# EAGLE design LevelConverter (EAGLE 9.4.2)
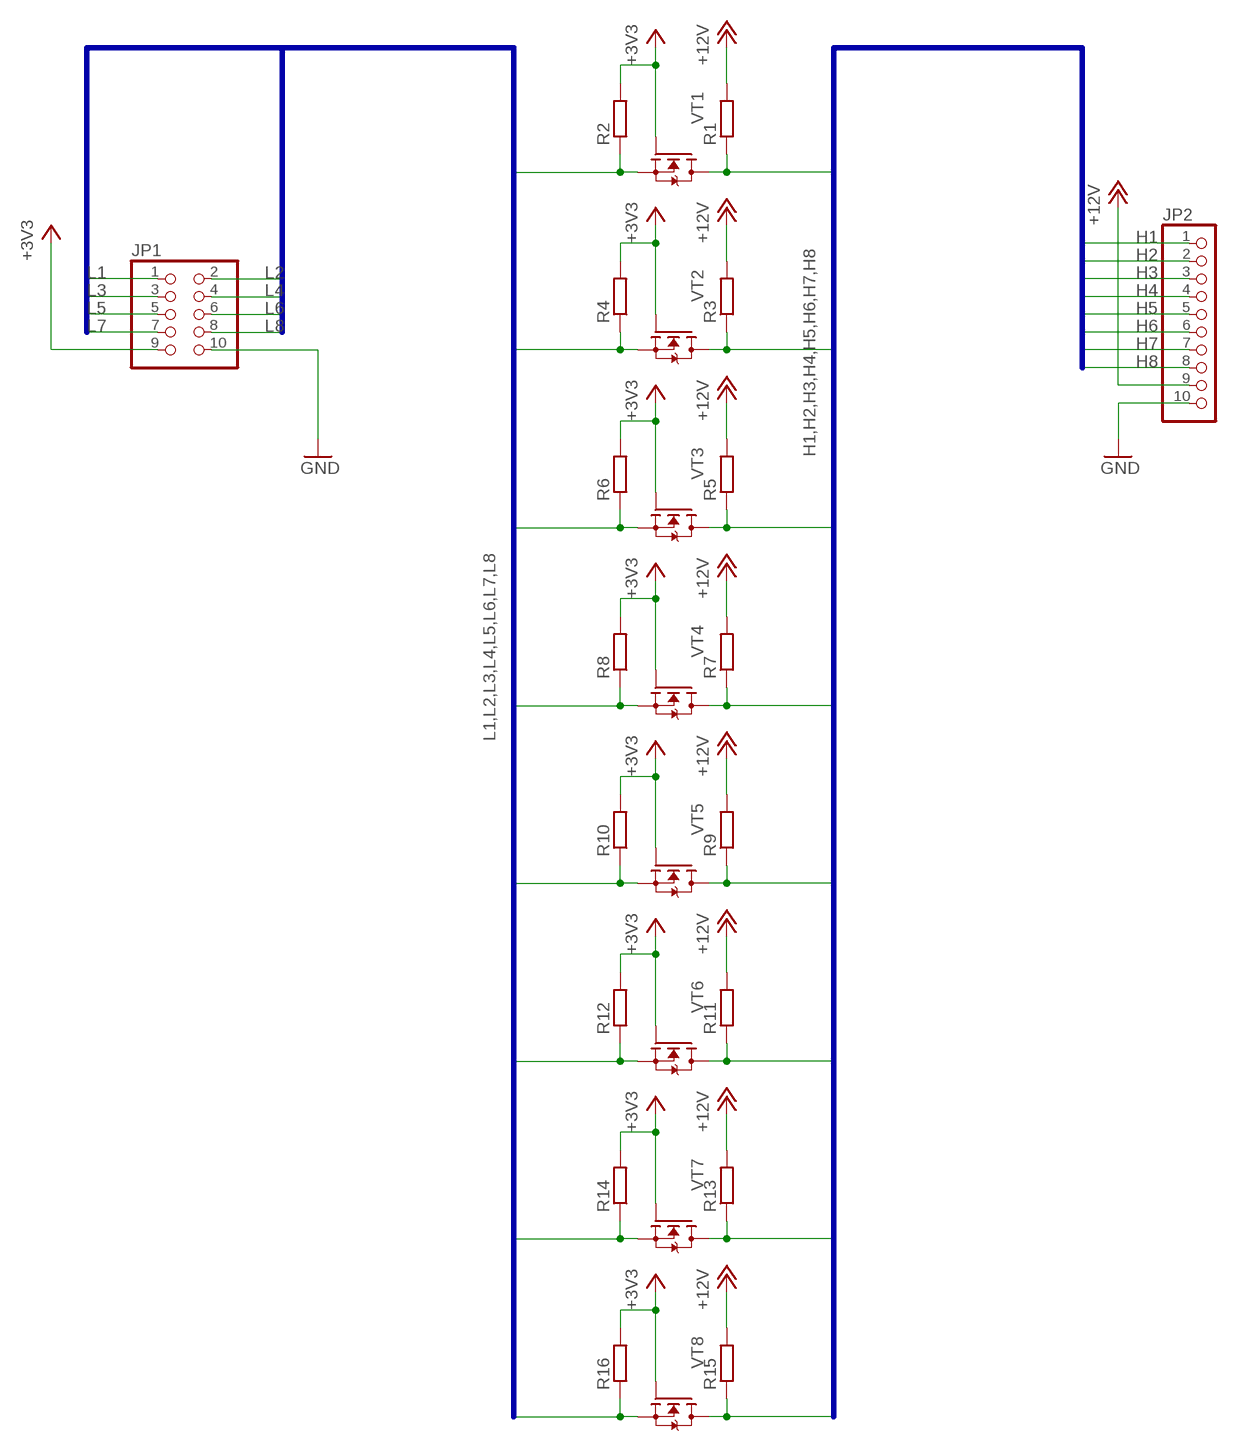
[diagram p0: schematic, sheet 1]

## Parts
JP1  PINHD-2X5/90  [2X05/90]
JP2  PINHD-1X10  [1X10]
R1  R_R0805  [RESC2012X50]
R2  R_R0805  [RESC2012X50]
R3  R_R0805  [RESC2012X50]
R4  R_R0805  [RESC2012X50]
R5  R_R0805  [RESC2012X50]
R6  R_R0805  [RESC2012X50]
R7  R_R0805  [RESC2012X50]
R8  R_R0805  [RESC2012X50]
R9  R_R0805  [RESC2012X50]
R10  R_R0805  [RESC2012X50]
R11  R_R0805  [RESC2012X50]
R12  R_R0805  [RESC2012X50]
R13  R_R0805  [RESC2012X50]
R14  R_R0805  [RESC2012X50]
R15  R_R0805  [RESC2012X50]
R16  R_R0805  [RESC2012X50]
VT1  FET-NSOT-23  [SOT95P240X115-3]
VT2  FET-NSOT-23  [SOT95P240X115-3]
VT3  FET-NSOT-23  [SOT95P240X115-3]
VT4  FET-NSOT-23  [SOT95P240X115-3]
VT5  FET-NSOT-23  [SOT95P240X115-3]
VT6  FET-NSOT-23  [SOT95P240X115-3]
VT7  FET-NSOT-23  [SOT95P240X115-3]
VT8  FET-NSOT-23  [SOT95P240X115-3]

## Nets
+3V3: JP1.9 R2.2 R4.2 R6.2 R8.2 R10.2 R12.2 R14.2 R16.2 VT1.1(G) VT2.1(G) VT3.1(G) VT4.1(G) VT5.1(G) VT6.1(G) VT7.1(G) VT8.1(G)
+12V: JP2.9 R1.2 R3.2 R5.2 R7.2 R9.2 R11.2 R13.2 R15.2
GND: JP1.10 JP2.10
H1: JP2.1 R1.1 VT1.3(D)
H2: JP2.2 R3.1 VT2.3(D)
H3: JP2.3 R5.1 VT3.3(D)
H4: JP2.4 R7.1 VT4.3(D)
H5: JP2.5 R9.1 VT5.3(D)
H6: JP2.6 R11.1 VT6.3(D)
H7: JP2.7 R13.1 VT7.3(D)
H8: JP2.8 R15.1 VT8.3(D)
L1: JP1.1 R2.1 VT1.2(S)
L2: JP1.2 R4.1 VT2.2(S)
L3: JP1.3 R6.1 VT3.2(S)
L4: JP1.4 R8.1 VT4.2(S)
L5: JP1.5 R10.1 VT5.2(S)
L6: JP1.6 R12.1 VT6.2(S)
L7: JP1.7 R14.1 VT7.2(S)
L8: JP1.8 R16.1 VT8.2(S)

## Buses
L1,L2,L3,L4,L5,L6,L7,L8
H1,H2,H3,H4,H5,H6,H7,H8

## Library data of the parts
JP1 = pinhead:PINHD-2X5: PIN HEADER
JP2 = pinhead:PINHD-1X10: PIN HEADER
R1-R16 = Flamberm:R_
VT1-VT8 = Flamberm:FET-N

## Board
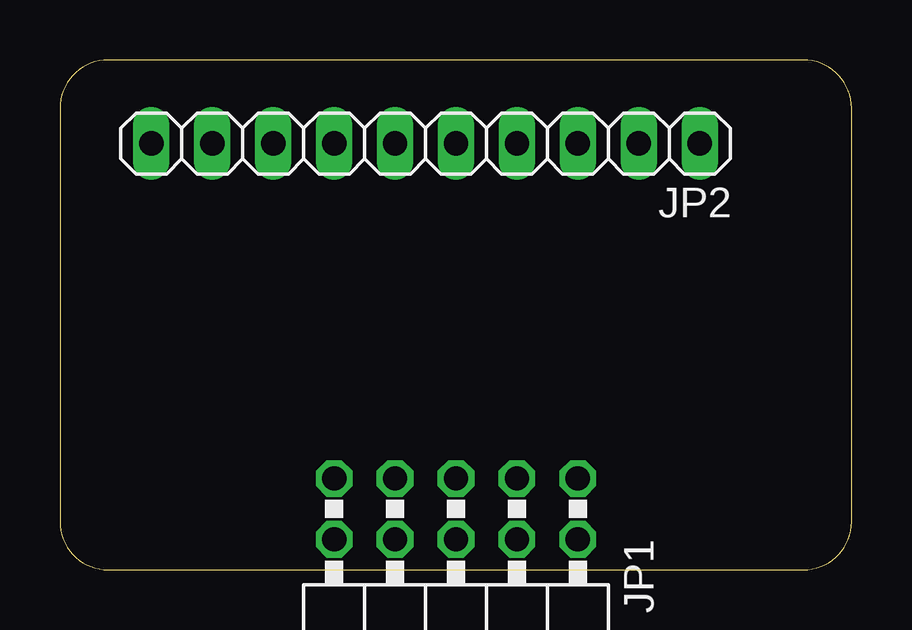
[diagram p1: board, top side]
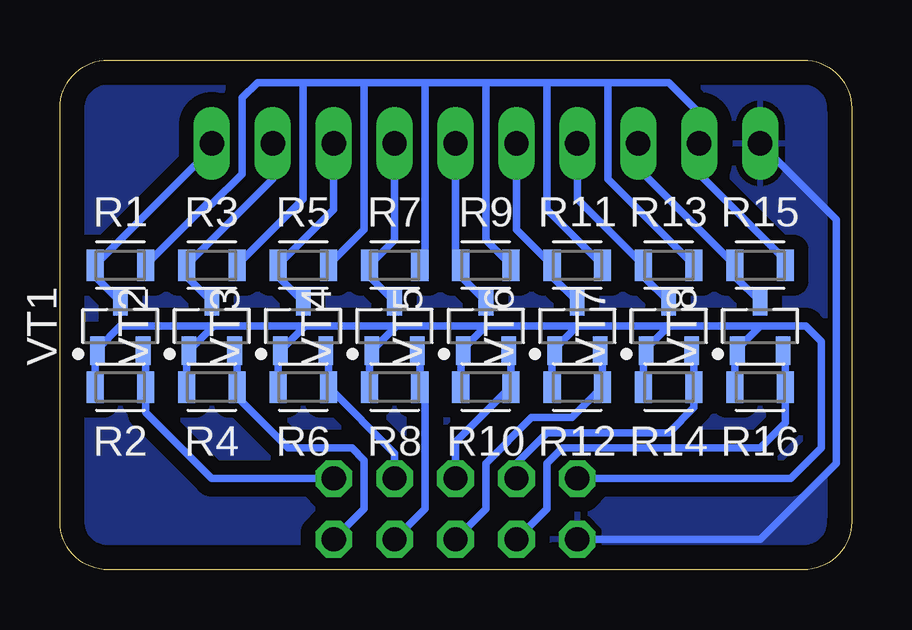
[diagram p2: board, bottom side, seen from below]

Size 33 x 21.26 mm. Coordinates in mm from the lower left corner, seen from the top.
Outline: 2,0 31,0 arc90 33,2 33,19.26 arc90 31,21.26 2,21.26 arc90 0,19.26 0,2 arc90 2,0
Copper layers (1*16): Top 0.035mm / dielectric 1.5mm / Bottom 0.035mm
Design rules "default": minimum track width 6mil, minimum drill 0.35mm, track to track 6mil, track to pad 6mil, pad to pad 6mil, via to via 6mil, smd to smd 6mil, copper to edge 40mil, drill to drill 6mil, minimum pad ring 10mil, minimum via ring 8mil, stop-mask expansion 4mil, vias tented up to drill 0mil, thermal gap 10mil

### Footprints (pad centres in the part's own frame; a part is rotated, then mirrored left to right if it is on the bottom)
2X05/90 = drill 1.016 octagon: 1 -5.08,-6.35; 2 -5.08,-3.81; 3 -2.54,-6.35; 4 -2.54,-3.81; 5 0,-6.35; 6 0,-3.81; 7 2.54,-6.35; 8 2.54,-3.81; 9 5.08,-6.35; 10 5.08,-3.81
1X10 = drill 1.016 long: 1 -11.43,0; 2 -8.89,0; 3 -6.35,0; 4 -3.81,0; 5 -1.27,0; 6 1.27,0; 7 3.81,0; 8 6.35,0; 9 8.89,0; 10 11.43,0
RESC2012X50 = smd 0.712 x 1.312: 1 -1.05,0; 2 1.05,0
SOT95P240X115-3 = smd 1.18 x 0.609: 1 -1.024,0.95; 2 -1.024,-0.95; 3 1.024,0

### Placement (x,y rotation side)
JP1  16.51,-2.54 180 top
JP2  15.24,17.78 180 top
R1  30.48,12.7 0 bottom
R2  30.48,7.62 180 bottom
R3  26.67,12.7 0 bottom
R4  26.67,7.62 180 bottom
R5  22.86,12.7 0 bottom
R6  22.86,7.62 180 bottom
R7  19.05,12.7 0 bottom
R8  19.05,7.62 180 bottom
R9  15.24,12.7 0 bottom
R10  15.24,7.62 180 bottom
R11  11.43,12.7 0 bottom
R12  11.43,7.62 180 bottom
R13  7.62,12.7 0 bottom
R14  7.62,7.62 180 bottom
R15  3.81,12.7 0 bottom
R16  3.81,7.62 180 bottom
VT1  30.48,10.16 90 bottom
VT2  26.67,10.16 90 bottom
VT3  22.86,10.16 90 bottom
VT4  19.05,10.16 90 bottom
VT5  15.24,10.16 90 bottom
VT6  11.43,10.16 90 bottom
VT7  7.62,10.16 90 bottom
VT8  3.81,10.16 90 bottom

### Tracks (layer width: path | path; a pad name or v marks a point on that pad's centre or on a via)
+3V3
  Bottom 0.305: R16.2 4.86,9.04 VT8.1 4.76,9.21 3.81,10.16 | R14.2 8.67,9.04 VT7.1 8.57,9.21 7.62,10.16 | R12.2 12.48,9.04 VT6.1 12.38,9.21 11.43,10.16 | R10.2 16.29,9.04 VT5.1 16.19,9.21 15.24,10.16 | R8.2 20.1,9.04 VT4.1 19.05,10.09 19.05,10.16 | R6.2 23.91,9.04 VT3.1 22.86,10.09 22.86,10.16 | R4.2 27.72,9.04 VT2.1 26.67,10.09 26.67,10.16 | R2.2 31.53,9.04 VT1.1 31.43,9.21 30.48,10.16 26.67,10.16 | 26.67,10.16 22.86,10.16 | 22.86,10.16 19.05,10.16 | 19.05,10.16 15.24,10.16 | 15.24,10.16 11.43,10.16 | 11.43,10.16 7.62,10.16 | 7.62,10.16 3.81,10.16 | 3.81,10.16 1.91,10.16 1.27,9.53 1.27,5.08 2.54,3.81 JP1.9
+12V
  Bottom 0.305: R15.2 2.76,12.92 6.35,16.51 JP2.9 6.35,19.05 7.62,20.32 10.16,20.32 | R13.2 10.16,16.29 10.16,20.32 | R11.2 12.7,15.02 12.7,20.32 | R9.2 15.24,13.75 15.24,20.32 | R7.2 17.78,12.92 17.78,20.32 | R5.2 20.32,14.19 20.32,20.32 | R3.2 22.86,15.46 22.86,20.32 | R1.2 26.89,15.24 26.67,15.24 25.4,16.51 25.4,19.68 24.77,20.32 22.86,20.32 | 22.86,20.32 20.32,20.32 | 20.32,20.32 17.78,20.32 | 17.78,20.32 15.24,20.32 | 15.24,20.32 12.7,20.32 | 12.7,20.32 10.16,20.32
GND
  Bottom 0.305: JP1.10 3.81,1.27 0.64,4.45 0.64,14.61 JP2.10
  pour Bottom (isolate 0.61): 2,0 31.02,0 arc90 33.02,2 33.02,19.59 arc90 31.02,21.59 2,21.59 arc90 0,19.59 0,2 arc90
H1
  Bottom 0.305: VT1.3 31.53,12.23 R1.1 26.67,17.56 JP2.1
H2
  Bottom 0.305: VT2.3 27.72,12.23 R3.1 24.13,16.29 JP2.2
H3
  Bottom 0.305: VT3.3 23.91,12.23 R5.1 21.59,15.02 JP2.3
H4
  Bottom 0.305: VT4.3 20.1,12.23 R7.1 19.05,13.75 JP2.4
H5
  Bottom 0.305: VT5.3 16.29,12.23 R9.1 16.51,12.92 JP2.5
H6
  Bottom 0.305: VT6.3 12.48,12.23 R11.1 13.97,14.19 JP2.6
H7
  Bottom 0.305: VT7.3 8.67,12.23 R13.1 11.43,15.46 JP2.7
H8
  Bottom 0.305: VT8.3 4.86,12.23 R15.1 8.89,16.73 JP2.8
L1
  Bottom 0.305: JP1.1 26.67,3.81 29.43,6.57 R2.1 29.43,9.04 VT1.2
L2
  Bottom 0.305: JP1.2 20.32,2.54 20.32,4.57 20.83,5.08 23.5,5.08 25.62,7.21 R4.1 25.62,9.04 VT2.2
L3
  Bottom 0.305: JP1.3 19.05,4.86 R6.1 21.81,9.04 VT3.2
L4
  Bottom 0.305: JP1.4 17.78,2.54 17.78,7.4 R8.1 18,9.04 VT4.2
L5
  Bottom 0.305: JP1.5 16.51,5.33 14.22,7.62 R10.1 14.19,9.04 VT5.2
L6
  Bottom 0.305: 10.38,7.4 R12.1 | JP1.6 15.24,2.54 15.24,4.45 13.34,6.35 11.65,6.35 R12.1 | R12.1 10.38,9.04 VT6.2
L7
  Bottom 0.305: JP1.7 13.97,4.45 12.7,5.71 7.62,5.71 6.57,6.76 R14.1 6.57,9.04 VT7.2
L8
  Bottom 0.305: JP1.8 12.7,2.54 12.7,4.43 12.05,5.08 3.81,5.08 2.76,6.13 R16.1 2.76,9.04 VT8.2